# EAGLE design untitled (EAGLE 7.2.0)
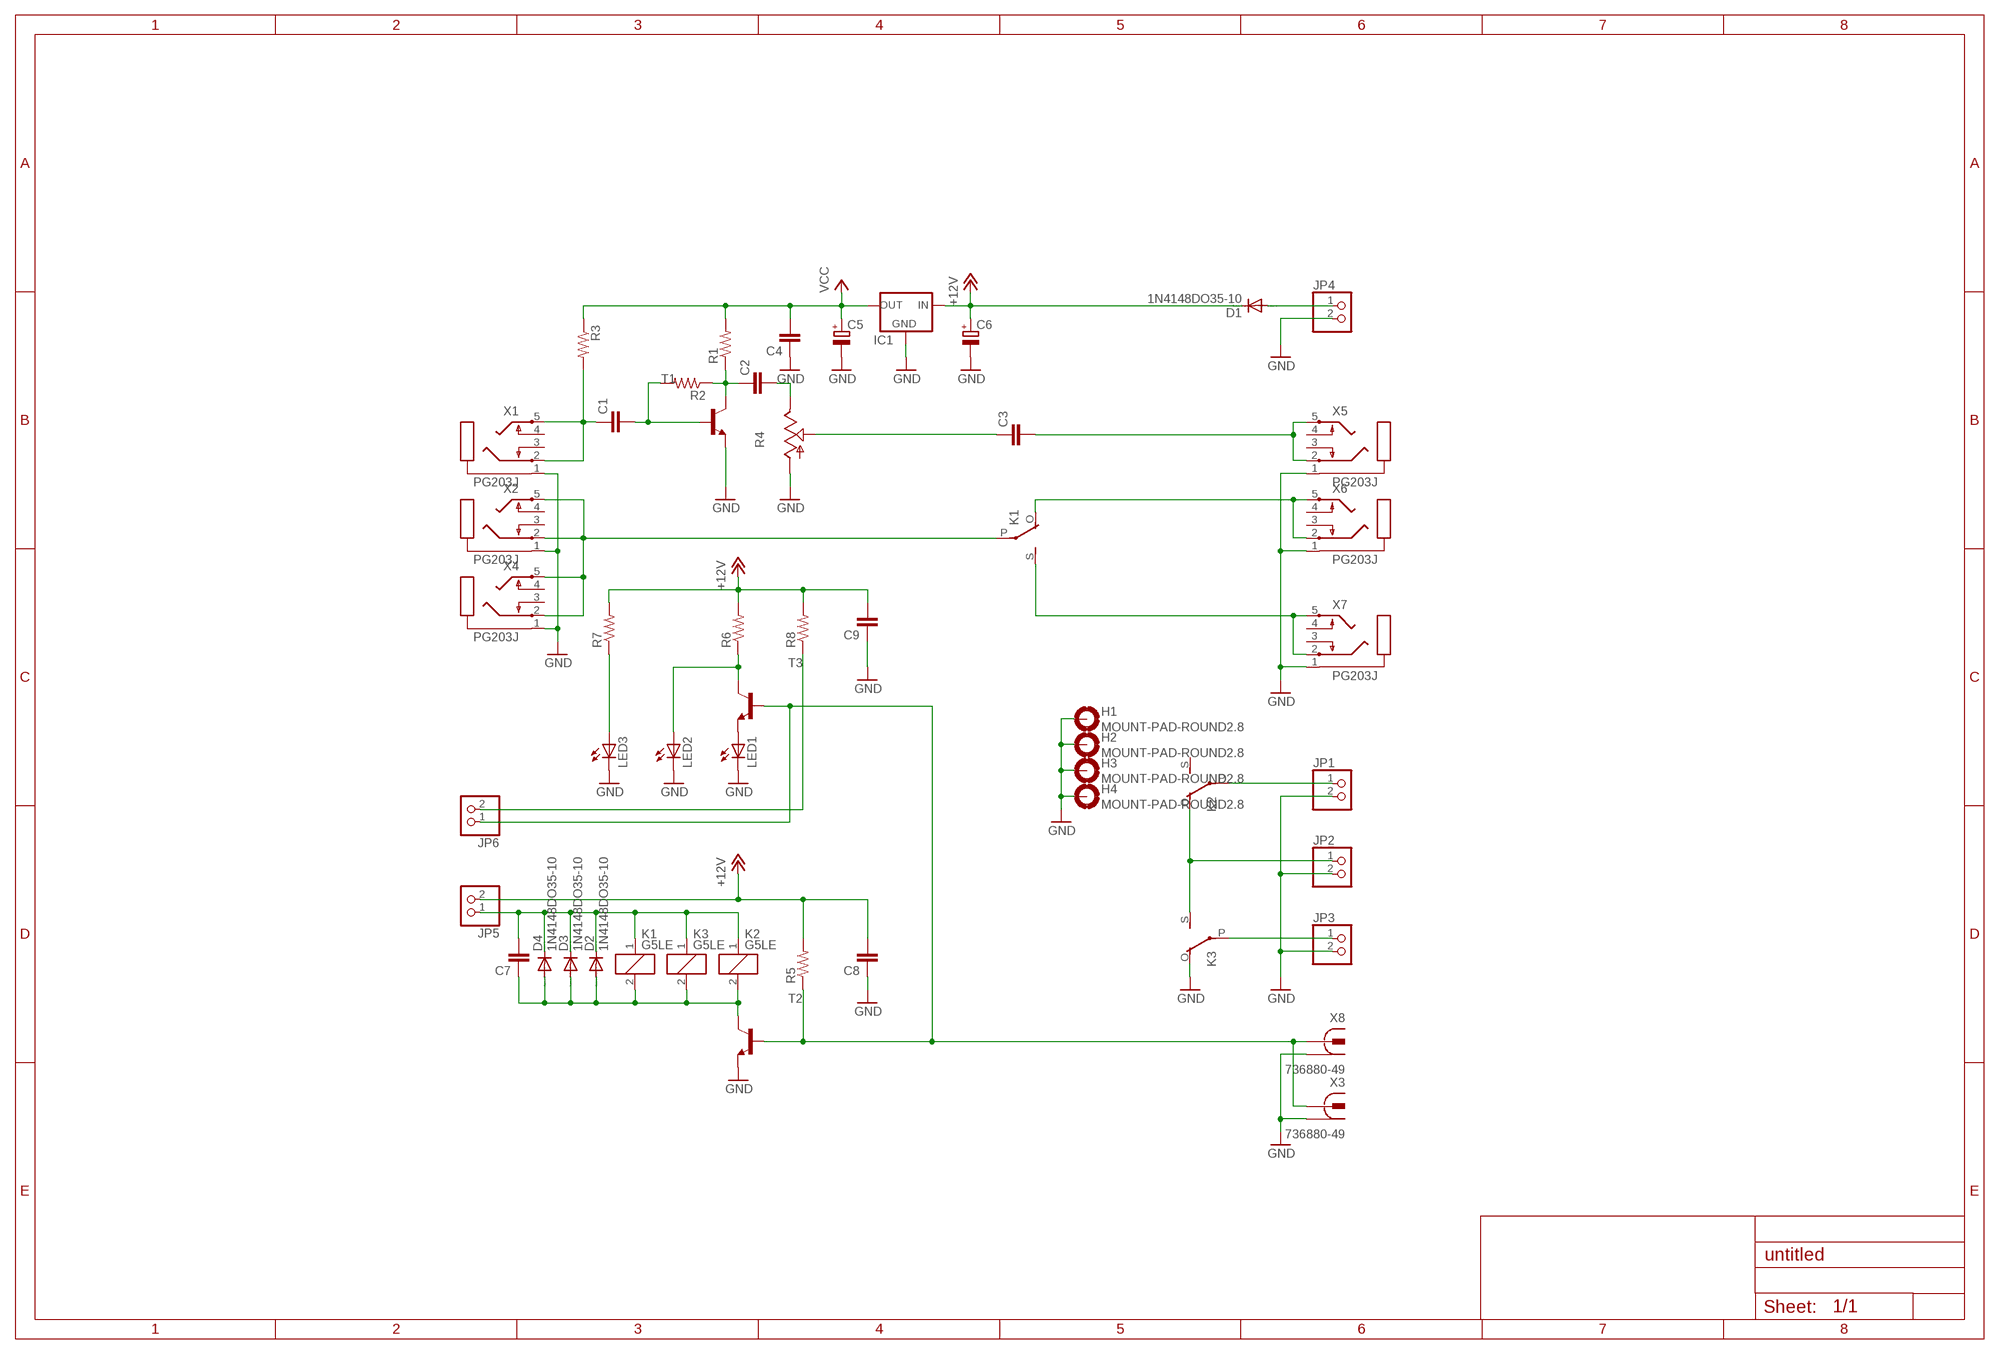
[diagram p0: schematic, sheet 1]

## Parts
C1  C-EU050-025X075  [C050-025X075]
C2  C-EU050-025X075  [C050-025X075]
C3  C-EU050-025X075  [C050-025X075]
C4  C-EU050-025X075  [C050-025X075]
C5  CPOL-EUE2.5-6  [E2,5-6]
C6  CPOL-EUE2.5-6  [E2,5-6]
C7  C-EU050-025X075  [C050-025X075]
C8  C-EU050-025X075  [C050-025X075]
C9  C-EU050-025X075  [C050-025X075]
D1  1N4148DO35-10  [DO35-10]
D2  1N4148DO35-10  [DO35-10]
D3  1N4148DO35-10  [DO35-10]
D4  1N4148DO35-10  [DO35-10]
H1  MOUNT-PAD-ROUND2.8  [2,8-PAD]
H2  MOUNT-PAD-ROUND2.8  [2,8-PAD]
H3  MOUNT-PAD-ROUND2.8  [2,8-PAD]
H4  MOUNT-PAD-ROUND2.8  [2,8-PAD]
IC1  78XXS  [78XXS]
JP1  PINHD-1X2  [1X02]
JP2  PINHD-1X2  [1X02]
JP3  PINHD-1X2  [1X02]
JP4  PINHD-1X2  [1X02]
JP5  PINHD-1X2  [1X02]
JP6  PINHD-1X2  [1X02]
K1  G5LE  [G5LE]
K2  G5LE  [G5LE]
K3  G5LE  [G5LE]
LED1  LED3MM  [LED3MM]
LED2  LED3MM  [LED3MM]
LED3  LED3MM  [LED3MM]
R1  R-US_0207/7  [0207/7]
R2  R-US_0207/7  [0207/7]
R3  R-US_0207/7  [0207/7]
R4  TRIM_US-CIP20C-6MM  [CIP20C-6MM]
R5  R-US_0207/7  [0207/7]
R6  R-US_0207/7  [0207/7]
R7  R-US_0207/7  [0207/7]
R8  R-US_0207/7  [0207/7]
T1  -NPN-TO92-EBC  [TO92-EBC]
T2  -NPN-TO92-EBC  [TO92-EBC]
T3  -NPN-TO92-EBC  [TO92-EBC]
X1  PG203J  [PG203J]
X2  PG203J  [PG203J]
X3  736880-49  [736880-49]
X4  PG203J  [PG203J]
X5  PG203J  [PG203J]
X6  PG203J  [PG203J]
X7  PG203J  [PG203J]
X8  736880-49  [736880-49]

## Nets
+12V: C6.+ C8.2 C9.2 D1.C IC1.IN JP5.2 R5.2 R6.2 R7.2 R8.2
GND: C4.1 C5.- C6.- C8.1 C9.1 H1.B2,8(MOUNT) H2.B2,8(MOUNT) H3.B2,8(MOUNT) H4.B2,8(MOUNT) IC1.GND JP1.2 JP2.2 JP3.2 JP4.2 K3.O(2:O) LED1.K(C) LED2.K(C) LED3.K(C) R4.A T1.E T2.E X1.1 X2.1 X3.1 X3.1@1 X3.1@2 X4.1 X5.1 X6.1 X7.1 X8.1 X8.1@1 X8.1@2
N$1: C3.1 R4.S
N$2: C1.1 R3.2 X1.2 X1.5
N$3: C1.2 R2.2 T1.B
N$4: C2.1 R1.1 R2.1 T1.C
N$5: C2.2 R4.E
N$6: JP6.1 R5.1 T2.B T3.B X3.2 X8.2
N$7: C3.2 X5.2 X5.5
N$8: K1.P(2:P) X2.2 X2.5 X4.2 X4.5
N$9: K1.O(2:O) X6.2 X6.5
N$10: K1.S(2:S) X7.2 X7.5
N$11: JP3.1 K3.P(2:P)
N$12: JP1.1 K2.P(2:P)
N$13: JP2.1 K2.O(2:O) K3.S(2:S)
N$14: D1.A JP4.1
N$15: C7.1 D2.A D3.A D4.A K1.2 K2.2 K3.2 T2.C
N$16: JP6.2 R8.1
N$19: C7.2 D2.C D3.C D4.C JP5.1 K1.1 K2.1 K3.1
N$20: LED1.A T3.E
N$21: LED2.A R6.1 T3.C
N$22: LED3.A R7.1
VCC: C4.2 C5.+ IC1.OUT R1.2 R3.1
Unconnected: K2.S(2:S) X1.3 X1.4 X2.3 X2.4 X4.3 X4.4 X5.3 X5.4 X6.3 X6.4 X7.3 X7.4

## Library data of the parts
C1-C4 C7-C9 = rcl:C-EU: CAPACITOR, European symbol
C5 C6 = rcl:CPOL-EU: POLARIZED CAPACITOR, European symbol
D1-D4 = diode:1N4148: DIODE high speed (Philips)
H1-H4 = holes:MOUNT-PAD-ROUND: MOUNTING PAD, round
IC1 = v-reg:78XXS: VOLTAGE REGULATOR
JP1-JP6 = pinhead:PINHD-1X2: PIN HEADER
K1-K3 = relay:G5LE: RELAY 1 x switch, 10 A/120 V AC, 8 A/30 V DC, Omron; OC_FARNELL: unknown; OC_NEWARK: unknown
LED1-LED3 = led:LED: LED OSRAM: - CHIPLED LG R971, LG N971, LY N971, LG Q971, LY Q971, LO R971, LY R971 LH N974, LH R974 LS Q976, LO Q976, LY Q976 LO Q996 - Hyper CHIPLED LW Q18S LB Q993, LB Q99A, LB R99A - SideLED LS A670, LO A670, LY A670, LG A670, LP A670 LB A673, LV A673, LT A673, LW A673 LH A674 LY A675 LS A676, LA A676, LO A676, LY A676, LW A676 LS A679, LY A679, LG A679 - Hyper Micro SIDELED® LS Y876, LA Y876, LO Y876, LY Y876 LT Y87S - SmartLED LW L88C, LW L88S LB L89C, LB L89S, LG L890 LS L89K, LO L89K, LY L89K LS L896, LA L896, LO L896, LY L896 - TOPLED LS T670, LO T670, LY T670, LG T670, LP T670 LSG T670, LSP T670, LSY T670, LOP T670, LYG T670 LG T671, LOG T671, LSG T671 LB T673, LV T673, LT T673, LW T673 LH T674 LS T676, LA T676, LO T676, LY T676, LB T676, LH T676, LSB T676, LW T676 LB T67C, LV T67C, LT T67C, LS T67K, LO T67K, LY T67K, LW E67C LS E67B, LA E67B, LO E67B, LY E67B, LB E67C, LV E67C, LT E67C LW T67C LS T679, LY T679, LG T679 LS T770, LO T770, LY T770, LG T770, LP T770 LB T773, LV T773, LT T773, LW T773 LH T774 LS E675, LA E675, LY E675, LS T675 LS T776, LA T776, LO T776, LY T776, LB T776 LHGB T686 LT T68C, LB T68C - Hyper Mini TOPLED® LB M676 - Mini TOPLED Santana® LG M470 LS M47K, LO M47K, LY M47K Source: http://www.osram.convergy.de LUXEON: - LUMILED® LXK2-PW12-R00, LXK2-PW12-S00, LXK2-PW14-U00, LXK2-PW14-V00 LXK2-PM12-R00, LXK2-PM12-S00, LXK2-PM14-U00 LXK2-PE12-Q00, LXK2-PE12-R00, LXK2-PE12-S00, LXK2-PE14-T00, LXK2-PE14-U00 LXK2-PB12-K00, LXK2-PB12-L00, LXK2-PB12-M00, LXK2-PB14-N00, LXK2-PB14-P00, LXK2-PB14-Q00 LXK2-PR12-L00, LXK2-PR12-M00, LXK2-PR14-Q00, LXK2-PR14-R00 LXK2-PD12-Q00, LXK2-PD12-R00, LXK2-PD12-S00 LXK2-PH12-R00, LXK2-PH12-S00 LXK2-PL12-P00, LXK2-PL12-Q00, LXK2-PL12-R00 Source: www.luxeon.com KINGBRIGHT: KA-3528ASYC Source: www.kingbright.com
R1-R3 R5-R8 = rcl:R-US_: RESISTOR, American symbol
R4 = pot:TRIM_US-: POTENTIOMETER
T1-T3 = transistor:*-NPN-: NPN Transistror BF959 corrected 2008.03.06
X1 X2 X4-X7 = con-hirschmann:PG203J: MIC/HEADPHONE JACK KS-S stereo microphone/headphone jack PG203JN (Schukat); OC_FARNELL: unknown; OC_NEWARK: unknown
X3 X8 = con-conrad:736880-49: Cinch Connector ( RCA Jack ) Cinch-Einbaukupplung 90º 72345 Vernickelt BKL Electronic Source: Conrad <http://www.conrad.de/ce/de/product/736880>

## Board
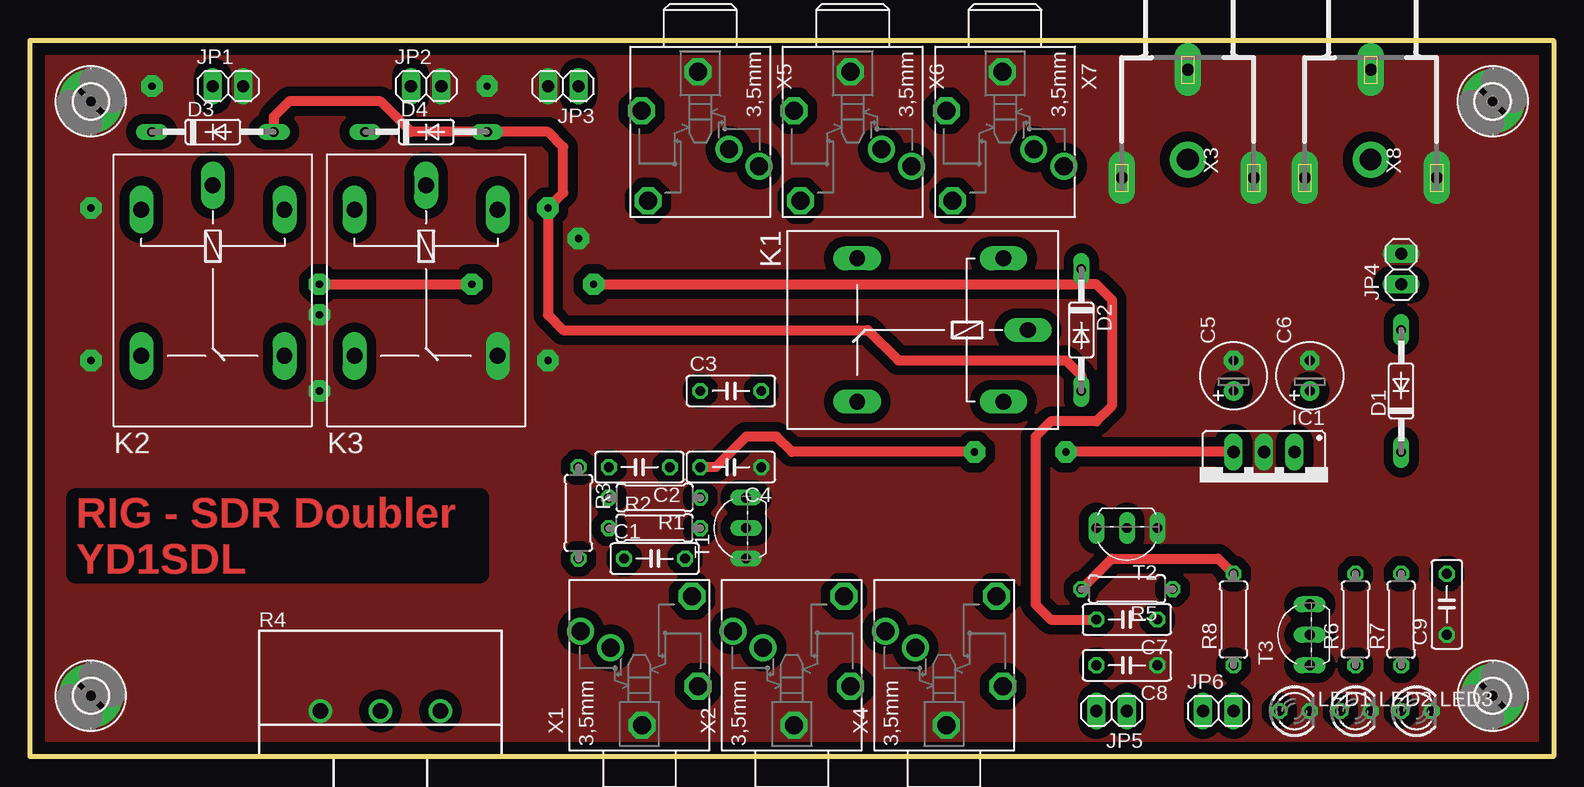
[diagram p1: board, top side]
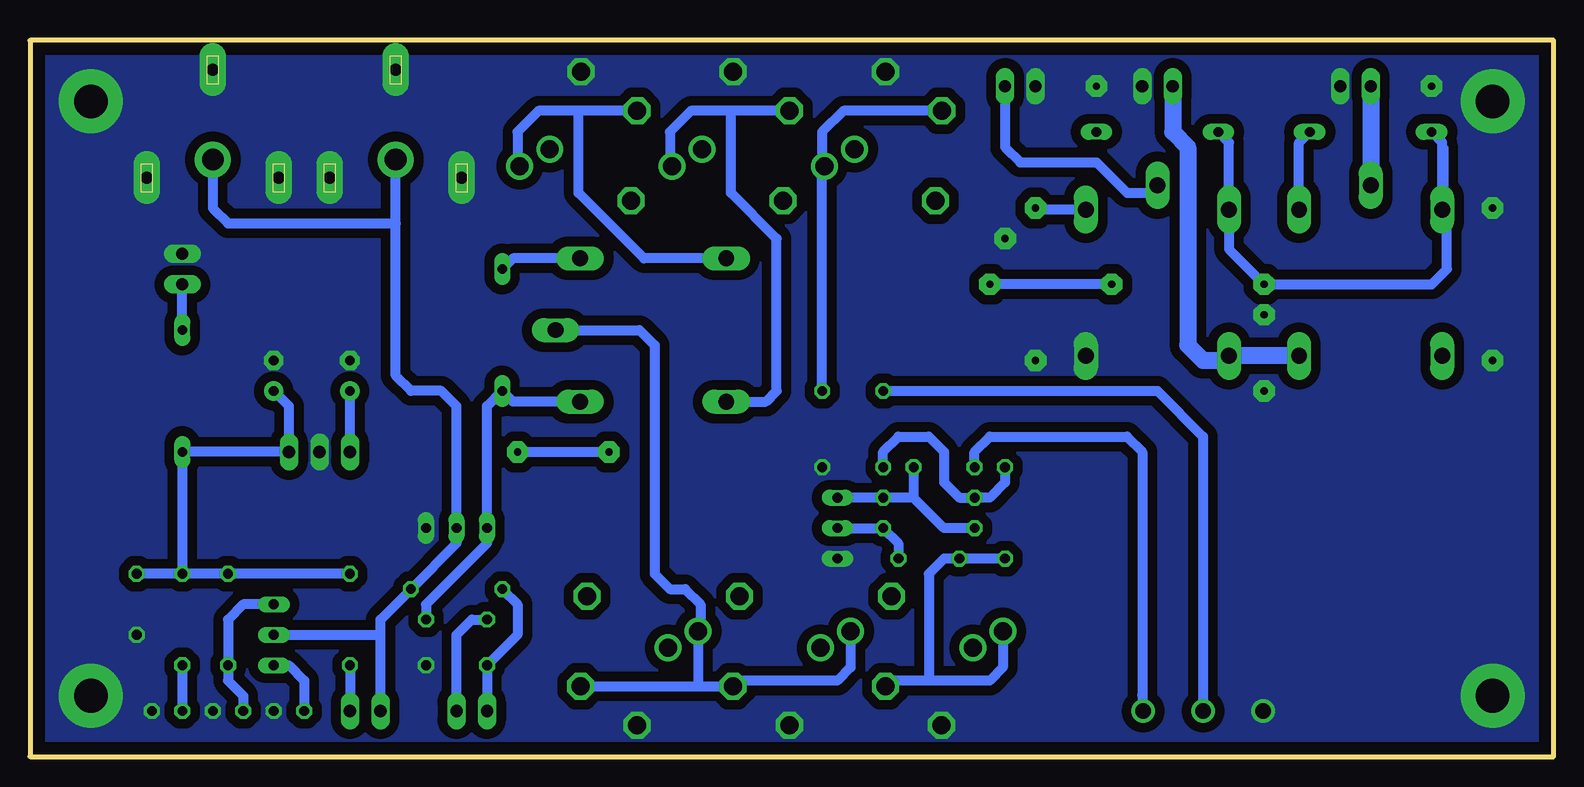
[diagram p2: board, bottom side, seen from below]

Size 127 x 59.69 mm. Coordinates in mm from the lower left corner, seen from the top.
Outline: 0,59.69 127,59.69 127,0 0,0 0,59.69
Copper layers (1*16): Top 0.035mm / dielectric 1.5mm / Bottom 0.035mm
Design rules "default": minimum track width 10mil, minimum drill 24mil, track to track 8mil, track to pad 8mil, pad to pad 8mil, via to via 8mil, smd to smd 8mil, copper to edge 40mil, drill to drill 8mil, minimum pad ring 10mil, minimum via ring 8mil, stop-mask expansion 4mil, vias tented up to drill 0mil, thermal gap 10mil

### Footprints (pad centres in the part's own frame; a part is rotated, then mirrored left to right if it is on the bottom)
C050-025X075 = drill 0.813 octagon: 1 -2.54,0; 2 2.54,0
E2,5-6 = drill 0.813 pad 1.6: + -1.27,0 | drill 0.813 pad 1.6 octagon: - 1.27,0
DO35-10 = drill 0.813 long: A 5.08,0; C -5.08,0
2,8-PAD = drill 2.8 pad 5.334: B2,8 0,0
78XXS = drill 1.016 long: GND 0,-2.54; IN -2.54,-2.54; OUT 2.54,-2.54
1X02 = drill 1.016 long: 1 -1.27,0; 2 1.27,0
G5LE = drill 1.321 long: 1 -7.493,-5.969; 2 -7.493,5.969; O 4.699,5.969; P -9.525,0; S 4.699,-5.969
LED3MM = drill 0.813 octagon: A -1.27,0; K 1.27,0
0207/7 = drill 0.813 octagon: 1 -3.81,0; 2 3.81,0
CIP20C-6MM = drill 1.3 pad 1.93: A -5,0; E 5,0; S 0,0
TO92-EBC = drill 0.813 long: B 0,-1.27; C 2.54,-1.27; E -2.54,-1.27
PG203J = drill 1.499 octagon: 1 -5.004,-0.203; 4 5.74,-4.369; 5 -1.753,-4.902 | drill 1.499: 2 2.845,4.902; 3 1.448,2.388
736880-49 = drill 1 pad 2.2 long: 1 -3.92,0; 1@1 5.08,-5.5; 1@2 5.08,5.5 | drill 1.8 pad 3: 2 3.58,0

### Placement (x,y rotation side)
C1  52.07,16.51 0 top
C2  50.8,24.13 180 top
C3  58.42,30.48 0 top
C4  58.42,24.13 180 top
C5  100.33,31.75 90 top
C6  106.68,31.75 90 top
C7  91.44,11.43 180 top
C8  91.44,7.62 180 top
C9  118.11,12.7 90 top
D1  114.3,30.48 90 top
D2  87.63,35.56 270 top
D3  15.24,52.07 0 top
D4  33.02,52.07 0 top
H1  121.92,54.61 0 top
H2  5.08,54.61 0 top
H3  5.08,5.08 0 top
H4  121.92,5.08 0 top
IC1  102.87,22.86 180 top
JP1  16.51,55.88 0 top
JP2  33.02,55.88 0 top
JP3  44.45,55.88 180 top
JP4  114.3,40.64 90 top
JP5  90.17,3.81 180 top
JP6  99.06,3.81 0 top
K1  73.66,35.56 180 top
K2  15.24,38.1 270 top
K3  33.02,38.1 270 top
LED1  105.41,3.81 0 top
LED2  110.49,3.81 0 top
LED3  115.57,3.81 0 top
R1  52.07,21.59 180 top
R2  52.07,19.05 0 top
R3  45.72,20.32 270 top
R4  29.21,3.81 0 top
R5  91.44,13.97 180 top
R6  110.49,11.43 90 top
R7  114.3,11.43 90 top
R8  100.33,11.43 90 top
T1  58.42,19.05 90 top
T2  91.44,17.78 180 top
T3  105.41,10.16 90 top
X1  50.8,7.62 90 top
X2  63.5,7.62 90 top
X3  96.52,53.34 270 top
X4  76.2,7.62 90 top
X5  55.88,52.07 270 top
X6  68.58,52.07 270 top
X7  81.28,52.07 270 top
X8  111.76,53.34 270 top

### Tracks (layer width: path | path; a pad name or v marks a point on that pad's centre or on a via)
+12V
  Top 0.813: R5.2 90.17,16.51 99.06,16.51 R8.2
  Bottom 0.813: R8.2 R6.2 R7.2 | R7.2 C9.2 | R5.2 86.36,12.7 86.36,10.16 C8.2 JP5.2 | R7.2 D1.C IC1.IN 105.41,29.21 C6.+
GND  (via drill 0.6 pad 1.78)
  other vias: 38.1,55.88 10.16,55.88 24.13,36.83 24.13,30.48 5.08,33.02 5.08,45.72 43.18,33.02 45.72,43.18
  pour Bottom (isolate 0.813, no thermals): 0,59.69 127,59.69 127,0 0,0
  pour Top (isolate 0.813, no thermals): 0,59.69 127,59.69 127,0 0,0
N$1
  Bottom 0.813: C3.1 33.02,30.48 29.21,26.67 R4.S
N$2
  Bottom 0.813: X1.2 45.9,7.44 46.99,6.35 52.07,6.35 | 52.07,6.35 55.22,6.35 X1.5 | R3.2 C1.1 50.8,16.51 52.07,15.24 52.07,6.35
N$3
  Bottom 0.813: T1.B R2.2 54.61,17.78 C1.2
N$4
  Bottom 0.813: R2.1 50.8,19.05 53.34,21.59 | 53.34,21.59 R1.1 T1.C | C2.1 53.34,21.59
N$5
  Bottom 0.813: C2.2 48.26,25.4 46.99,26.67 35.56,26.67 34.29,25.4 34.29,5.16 R4.E
N$6
  Bottom 0.813: T3.B 97.79,10.16 | 97.79,10.16 97.79,11.43 R5.1 91.44,17.78 T2.B 91.44,29.21 92.71,30.48 95.25,30.48 96.52,31.75 96.52,44.45 | JP6.1 97.79,10.16 | X8.2 111.76,45.72 110.49,44.45 96.52,44.45 | 96.52,44.45 X3.2
N$7
  Bottom 0.813: X5.5 59.21,53.82 60.96,52.07 60.96,49.4 X5.2 60.96,49.05 C3.2
N$8
  Bottom 0.813: X2.2 58.6,7.44 59.69,6.35 67.92,6.35 X2.5 71.12,5.87 | X4.5 71.12,5.87 | 71.12,5.87 71.3,6.04 X4.2 71.12,10.64 71.12,12.7 72.39,13.97 73.66,13.97 74.93,15.24 74.93,34.29 76.2,35.56 K1.P
N$9
  Bottom 0.813: X6.5 68.58,53.82 | 68.58,53.82 71.91,53.82 73.66,52.07 73.66,49.4 X6.2 | K1.O 65.66,29.59 64.77,30.48 64.77,43.18 68.58,46.99 68.58,53.82
N$10
  Bottom 0.813: X7.5 81.28,53.82 | 81.28,53.82 84.61,53.82 86.36,52.07 86.36,49.4 X7.2 | K1.S 75.82,41.53 81.28,46.99 81.28,53.82
N$11
  Bottom 0.813: JP3.1 45.72,50.8 44.45,49.53 38.1,49.53 35.56,46.99 33.66,46.99 K3.P
N$12
  Bottom 1.422: JP1.1 K2.P
N$13
  Bottom 1.422: K2.O K3.S 27.43,33.02 29.21,33.02 30.48,34.29 30.48,50.8 31.75,52.07 JP2.1
N$14
  Bottom 0.813: D1.A JP4.1
N$15  (via drill 0.6 pad 1.78)
  Top 0.813: D3.A 20.32,53.34 21.59,54.61 29.21,54.61 31.75,52.07 D4.A 43.18,52.07 44.45,50.8 44.45,46.99 v43.18,45.72 43.18,36.83 44.45,35.56 69.85,35.56 72.39,33.02 86.36,33.02 87.63,31.75 D2.A
  Bottom 0.813: K2.2 21.21,51.18 D3.A | K1.2 86.74,29.59 D2.A 88.9,29.21 T2.C 88.9,17.78 93.98,12.7 C7.1 | K3.2 43.05,45.59 v43.18,45.72
N$16
  Bottom 0.813: R8.1 JP6.2
N$19  (via drill 0.6 pad 1.78)
  Top 0.813: v24.13,39.37 v36.83,39.37 | v46.99,39.37 87.63,39.37 | 87.63,39.37 D2.C | 87.63,39.37 88.9,39.37 90.17,38.1 90.17,29.21 88.9,27.94 85.09,27.94 83.82,26.67 83.82,12.7 85.09,11.43 C7.2
  Bottom 0.254: D3.C 8.89,50.8 8.89,46.99 10.16,45.72
  Bottom 0.813: D3.C 9.27,51.18 K2.1 8.89,45.21 8.89,40.64 10.16,39.37 v24.13,39.37 27.05,42.29 K3.1 27.05,51.18 D4.C | K1.1 86.74,41.53 D2.C | JP5.1 91.44,10.16 90.17,11.43 C7.2 | v36.83,39.37 v46.99,39.37
N$20
  Bottom 0.813: T3.E 105.41,7.62 104.14,6.35 LED1.A
N$21
  Bottom 0.813: T3.C 109.22,12.7 110.49,11.43 R6.1 110.49,6.35 109.22,5.08 LED2.A
N$22
  Bottom 0.813: R7.1 LED3.A
VCC  (via drill 0.6 pad 1.78)
  Top 0.813: IC1.OUT v86.36,25.4 | v78.74,25.4 63.5,25.4 62.23,26.67 59.69,26.67 57.15,24.13 C4.2
  Bottom 0.813: R3.1 45.72,22.86 46.99,21.59 R1.2 49.53,21.59 50.8,22.86 50.8,25.4 52.07,26.67 54.61,26.67 55.88,25.4 C4.2 | v86.36,25.4 v78.74,25.4 | IC1.OUT C5.+
(copper drawn outside any net)
  shapes: Top area x2

### Text on the board
Top: RIG - SDR Doubler / YD1SDL